# Altium schematic sheet ADXL001.SchDoc
size A4
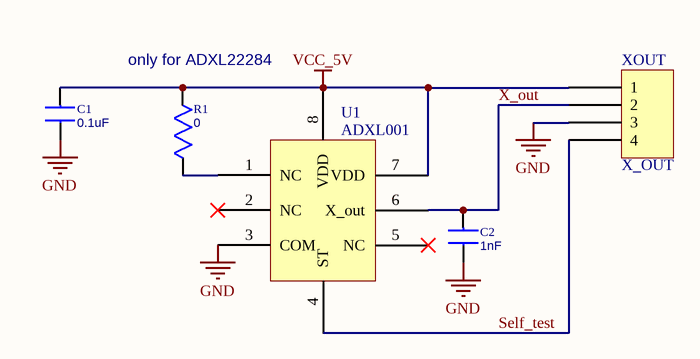
[diagram p0: ADXL001.SchDoc]

## Parts
C1  0.1uF  [C_0805]
C2  1nF  [C_0805]
R1  only for ADXL22284  value 0  [R_0805]
U1  ADXL001  [E-8-1]
XOUT  X_OUT  [4_pin_plate_conn]

## Nets
GND: C1.1 C2.1 U1.3(COM) XOUT.3
VCC_5V: C1.2 R1.1 U1.7(VDD) U1.8(VDD) XOUT.1
Self_test: U1.4(ST) XOUT.4
X_out: C2.2 U1.6(X_out) XOUT.2
NetR1_2: R1.2 U1.1(NC)

Not connected (* = marked no-connect by the designer): U1 2(NC)* 5(NC)*

## Library data of the parts
C1 C2 = C0805: Capacitor
  C1: Value: 0.1uF
  C2: Value: 1nF
R1 = R0805: Resistor
U1 = ADXL001: Analog devices accelerometer
XOUT = 4_pin_plate_conn